# EAGLE schematic ponte_ampli_V1.1 (EAGLE 4.09)
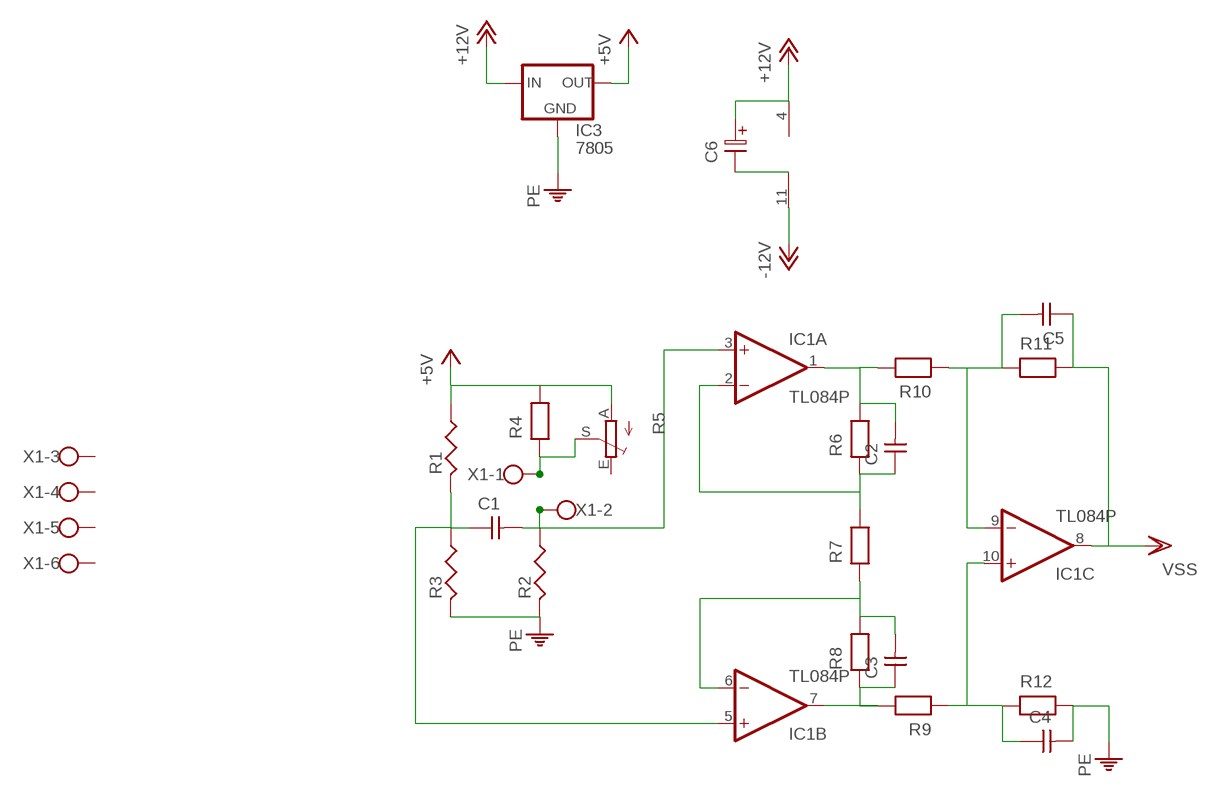
[diagram p0: schematic, sheet 1]

## Parts
C1  CAPNP-5  [C-5]
C2  CAPNP-5  [C-5]
C3  CAPNP-5  [C-5]
C4  CAPNP-5  [C-5]
C5  CAPNP-5  [C-5]
C6  ELC-2,5L  [ES-2,5L]
IC1  TL084P  [DIL14]
IC3  7805  78XXL  [78XXL]
R1  RESUS-7,5  [R-7,5]
R2  RESUS-7,5  [R-7,5]
R3  RESUS-7,5  [R-7,5]
R4  RESEU-7,5  [R-7,5]
R5  TRIM_EU-S64W  [S64W]
R6  RESEU-7,5  [R-7,5]
R7  RESEU-7,5  [R-7,5]
R8  RESEU-7,5  [R-7,5]
R9  RESEU-7,5  [R-7,5]
R10  RESEU-7,5  [R-7,5]
R11  RESEU-7,5  [R-7,5]
R12  RESEU-7,5  [R-7,5]
X1  AK500/6  [AK500/6]

## Nets
+5V: IC3.OUT R1.1 R4.2 R5.A
+12V: C6.1 IC1.4(P:V+) IC3.IN
-12V: IC1.11(P:V-)
N$1: C1.1 IC1.5(B:+IN) R1.2 R3.1
N$2: C1.2 IC1.3(A:+IN) R2.1 X1.2
N$3: C5.2 IC1.9(C:-IN) R10.1 R11.1
N$4: C2.2 IC1.1(A:OUT) R6.2 R10.2
N$5: R4.1 R5.S X1.1
N$6: C4.1 IC1.10(C:+IN) R9.1 R12.1
N$7: C2.1 IC1.2(A:-IN) R6.1 R7.2
N$8: C6.2
N$9: C3.1 IC1.7(B:OUT) R8.1 R9.2
N$15: C3.2 IC1.6(B:-IN) R7.1 R8.2
PE: C4.2 IC3.GND R2.2 R3.2 R12.2
VSS: C5.1 IC1.8(C:OUT) R11.2
Unconnected: IC1.12(D:+IN) IC1.13(D:-IN) IC1.14(D:OUT) R5.E X1.3 X1.4 X1.5 X1.6

## Library data of the parts
C1-C5 = discrete:CAPNP-5
C6 = discrete:ELC-2,5L
IC1 = linear:TL084: OP AMP
IC3 = v-reg:78XXL: VOLTAGE REGULATOR
R1-R3 = discrete:RESUS-7,5
R4 R6-R12 = discrete:RESEU-7,5
R5 = pot:TRIM_EU-: POTENTIOMETER
X1 = con-ptr500:AK500/6: CONNECTOR